# Altium schematic sheet Trigger_Input.SchDoc
size A; SheetNumber: 11; SheetTotal: 12
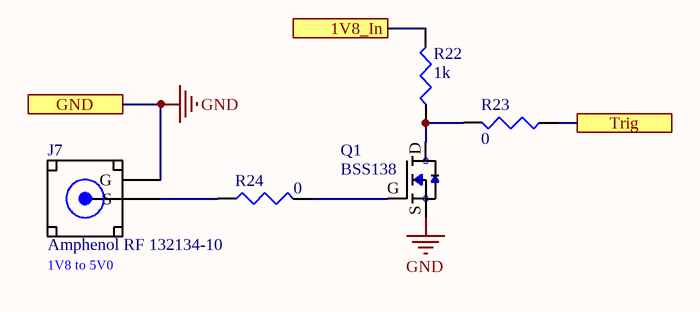
[diagram p0: Trigger_Input.SchDoc]

## Parts
J7  Amphenol RF 132134-10  [Amphenol RF 132134-10 HFSS 8.8 mil]
Q1  BSS138  [BSS138-SOT23]
R22  1k  [SMD-0603]
R23  0  [SMD-0603]
R24  0  [SMD-0603]

## Ports
1V8_In, GND, Trig

## Nets
GND: J7.G Q1.S ; port GND
1V8_In: R22.2 ; port 1V8_In
Trig: R23.1 ; port Trig
NetJ7_S: J7.S R24.1
NetQ1_D: Q1.D R22.1 R23.2
NetQ1_G: Q1.G R24.2

## Notes on the sheet
- (near J7) 1V8 to 5V0

## Library data of the parts
J7 = Amphenol RF 132134-10: RF / Coaxial Connector, SMA Coaxial, Straight Jack, Surface Mount Vertical, 50 ohm; MF: Samtec; MP: SMA-J-P-H-ST-EM1; Price: None; SnapEDA_Link: https://www.snapeda.com/parts/SMA-J-P-H-ST-EM1/Samtec%20Inc./view-part/?ref=snap; Package: None; Availability: Unavailable; Value: *
Q1 = BSS138: N-Channel Logic Level Enhancement Mode Field Effect Transistor; MF: MICROSS/On Semiconductor; MP: BSS138; Price: None; Availability: Unavailable; Package: TO-236-3 Micross; SnapEDA_Link: https://www.snapeda.com/parts/BSS138/MICROSS/On%20Semiconductor/view-part/?ref=snap; Value: *
R22-R24 = RES0603: Resistor-0603